# EasyEDA Pro project ProPrj_pbsy3.0_2025-02-05.epro

# Schematic Schematic1
Board Name: Board1; Create Date: 2025-01-28; Page Name: P1; Project Name: pbsy3.0; Schematic Name: Schematic1; Update Date: 2025-02-05; Company: King; Page Size: A4; Version: V1.0
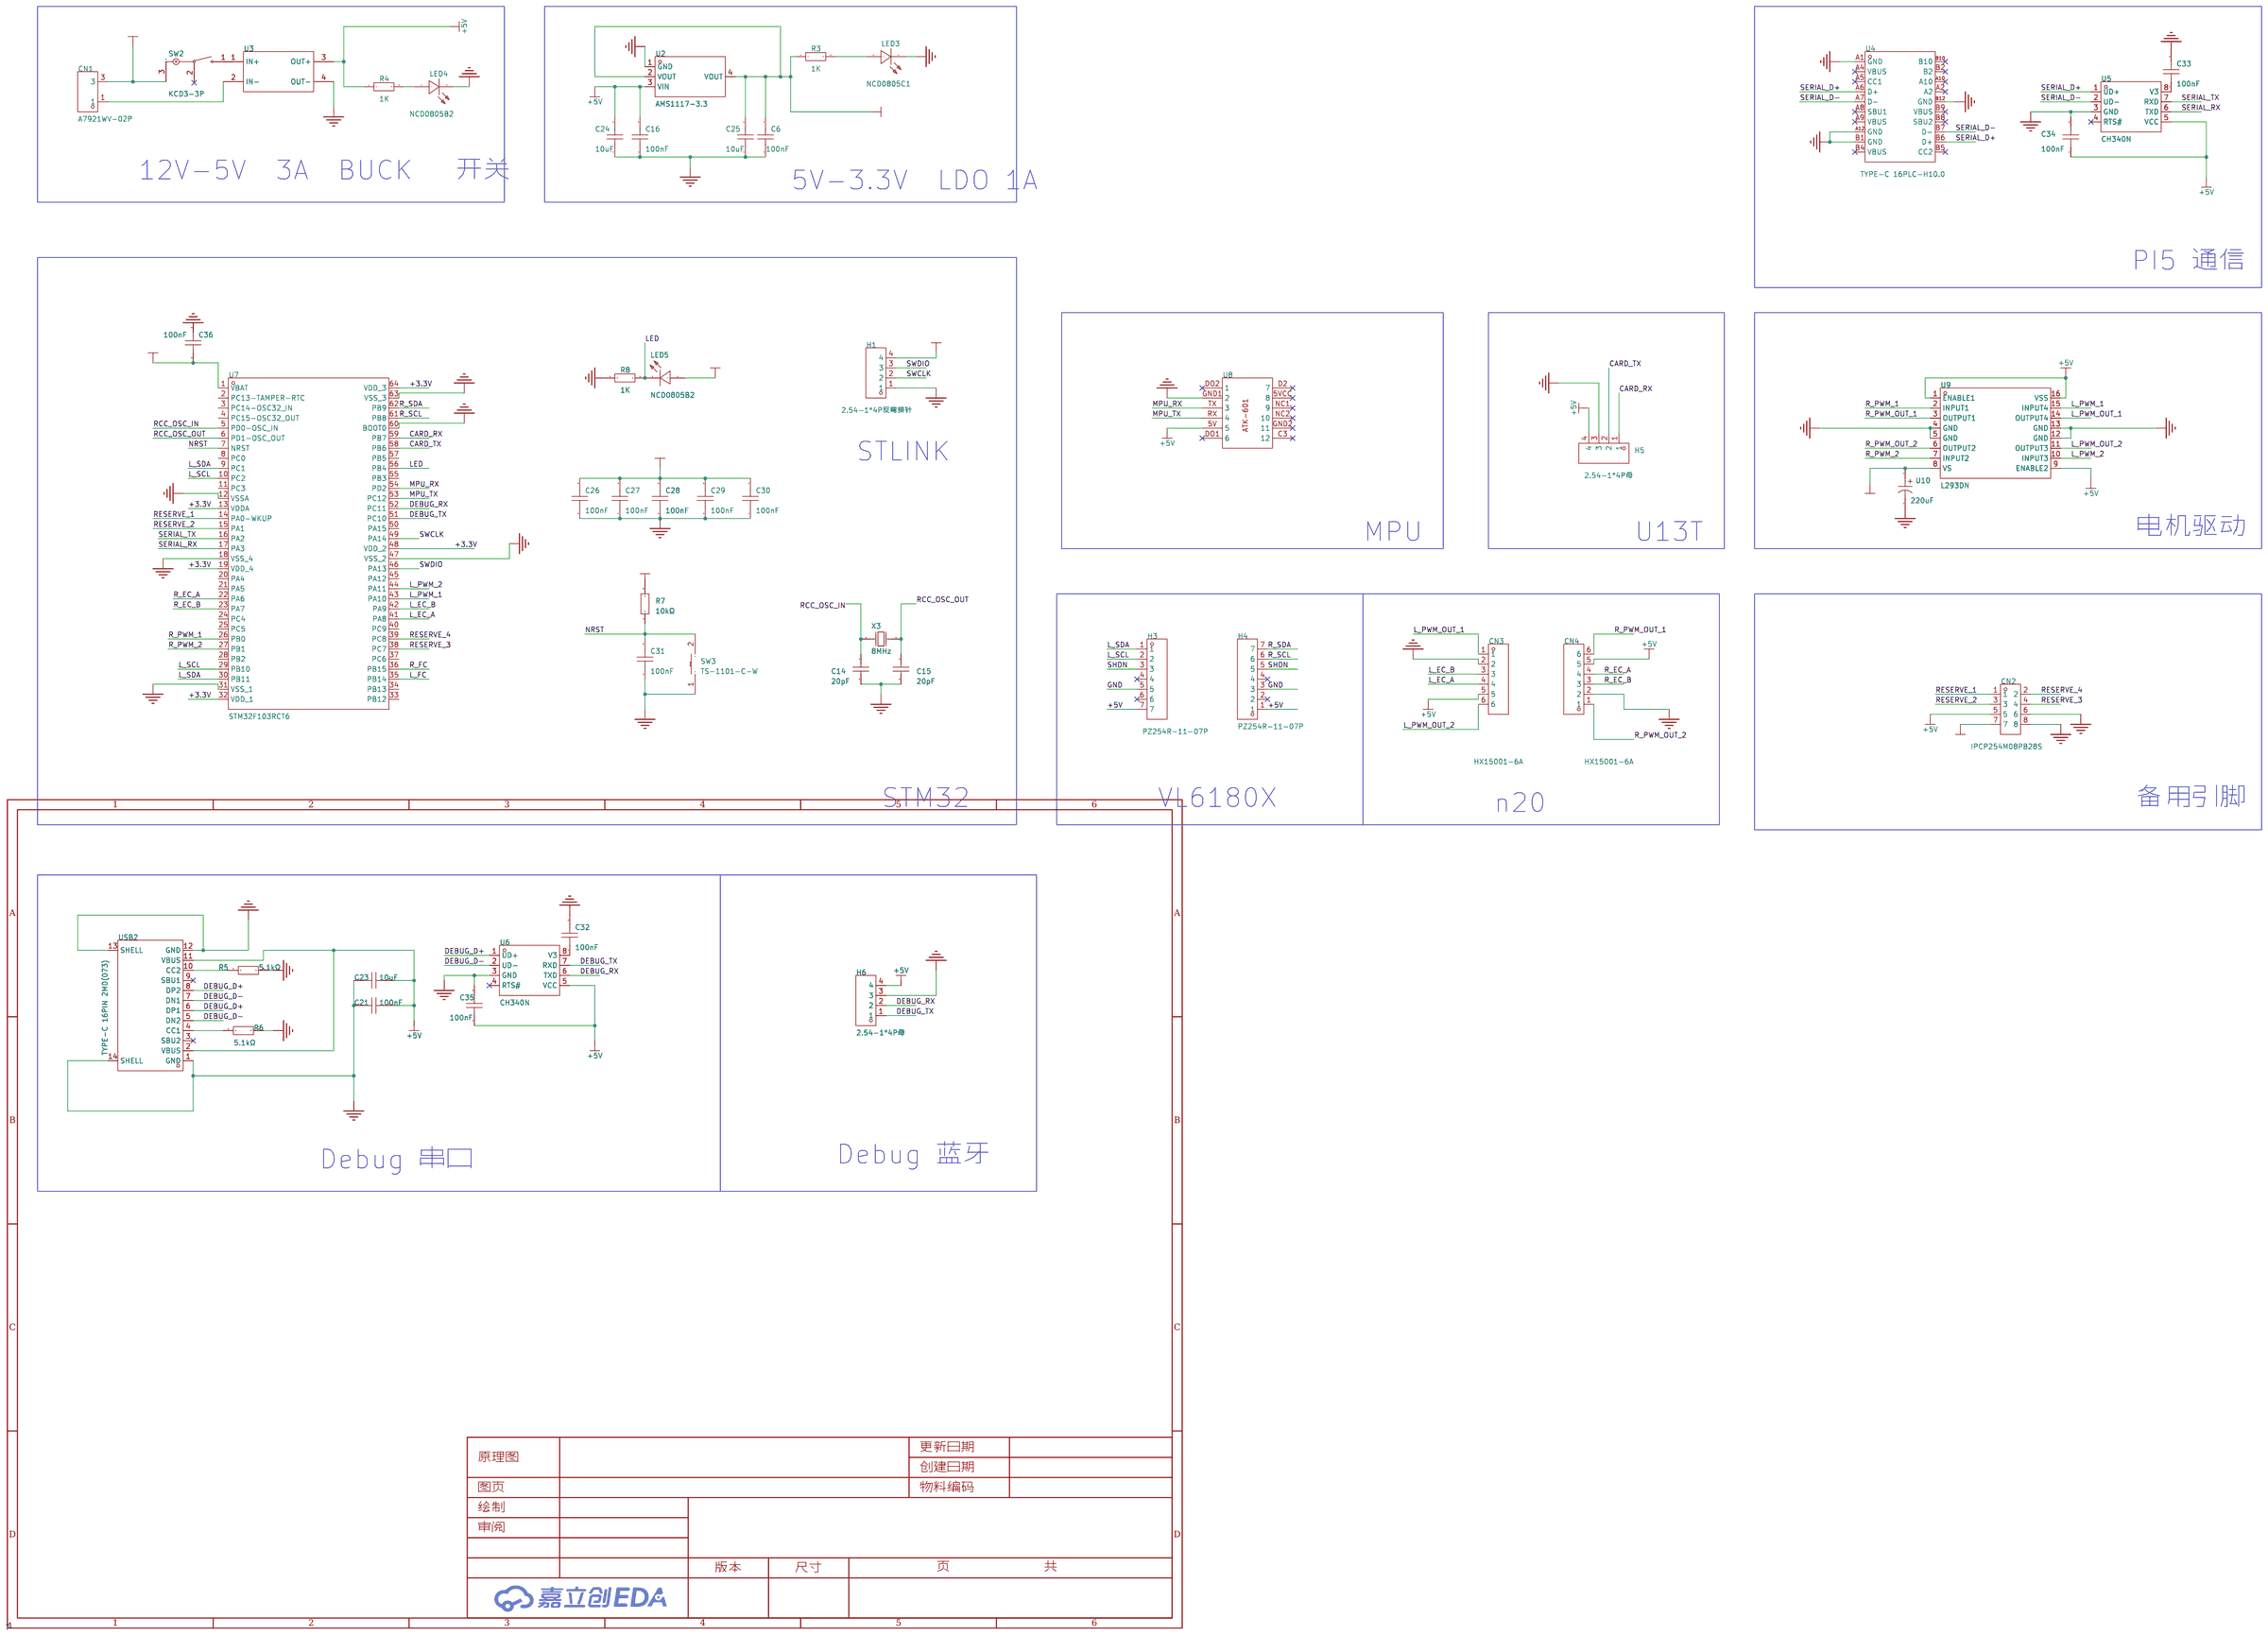
[diagram p0: schematic sheet]

## Parts
C6  100nF  [C0603]
C14  20pF  [C0805]
C15  20pF  [C0805]
C16  100nF  [C0603]
C21  100nF  [C0603]
C23  10uF  [C0805]
C24  10uF  [C0805]
C25  10uF  [C0805]
C26  100nF  [C0603]
C27  100nF  [C0603]
C28  100nF  [C0603]
C29  100nF  [C0603]
C30  100nF  [C0603]
C31  100nF  [C0603]
C32  100nF  [C0603]
C33  100nF  [C0603]
C34  100nF  [C0603]
C35  100nF  [C0603]
C36  100nF  [C0603]
CN1  A7921WV-02P  [CONN-TH_A7921WR-02P]
CN2  IPCP254M08PB28S  [HDR-SMD_8P-P2.54-V-M-R2-C4-S2.54-LS7.4]
CN3  HX15001-6A  [CONN-TH_HX15001-6A]
CN4  HX15001-6A  [CONN-TH_HX15001-6A]
H1  2.54-1*4P反弯排针  [HDR-TH_4P-P2.54-H-M-W10.4]
H3  PZ254R-11-07P  [HDR-TH_7P-P2.54-H-M-W10.4]
H4  PZ254R-11-07P  [HDR-TH_7P-P2.54-H-M-W10.4]
H5  2.54-1*4P母  [HDR-TH_4P-P2.54-V-F]
H6  2.54-1*4P母  [HDR-TH_4P-P2.54-V-F]
LED3  NCD0805C1  [LED0805-RD]
LED4  NCD0805B2  [LED0805-R-RD]
LED5  NCD0805B2  [LED0805-R-RD]
R3  1K  [R0603]
R4  1K  [R0603]
R5  5.1kΩ  [R0603]
R6  5.1kΩ  [R0603]
R7  10kΩ  [R0603]
R8  1K  [R0603]
SW2  KCD3-3P  [SW-TH_KCD3-3P]
SW3  TS-1101-C-W  [SW-SMD_L6.0-W3.3-LS8.0]
U2  AMS1117-3.3  [SOT-223-3_L6.5-W3.4-P2.30-LS7.0-BR]
U3  -  [12v-5v]
U4  TYPE-C 16PLC-H10.0  [TYPE-C-TH_16PLC-H10.0]
U5  CH340N  [SOP-8_L4.9-W3.9-P1.27-LS6.0-BL]
U6  CH340N  [SOP-8_L4.9-W3.9-P1.27-LS6.0-BL]
U7  STM32F103RCT6  [LQFP-64_L10.0-W10.0-P0.50-LS12.0-BL]
U8  -  [ATK-601]
U9  L293DN  [DIP-16_L19.2-W6.6-P2.54-LS7.6-BL]
U10  220uF  [CAP-SMD_BD10.0-L10.3-W10.3-LS11.3-FD]
USB2  TYPE-C 16PIN 2MD(073)  [USB-C-SMD_TYPE-C-6PIN-2MD-073]
X3  8MHz  [CRYSTAL-SMD_L5.0-W3.2]

## Library data of the parts
C6 C16 C21 C26-C36 = CC0603KRX7R9BB104: 容值:100nF;精度:±10%;额定电压:50V;材质(温度系数):X7R;; LCSC Part Name: 100nF ±10% 50V; Supplier Part: C14663; Manufacturer: YAGEO(国巨); Supplier Footprint: 0603; JLCPCB Part Class: 基础库; Datasheet: https://atta.szlcsc.com/upload/public/pdf/source/20180910/C282072_33301C7F631E79921B82A8DAC6BCC5B3.pdf; Supplier: LCSC; Tolerance: ±10%; Voltage Rated: 50V; Temperature Coefficient: X7R
C14 C15 = CL21C200JBANNNC: 容值:20pF;精度:±5%;额定电压:50V;材质(温度系数):C0G;; LCSC Part Name: 20pF ±5% 50V; Supplier Part: C1798; Manufacturer: SAMSUNG(三星); Supplier Footprint: 0805; JLCPCB Part Class: 基础库; Datasheet: https://atta.szlcsc.com/upload/public/pdf/source/20160218/1457707763339.pdf; Supplier: LCSC; Tolerance: ±5%; Voltage Rated: 50V; Temperature Coefficient: C0G
C23-C25 = CL21A106KAYNNNE_C15850: 容值:10uF;精度:±10%;额定电压:25V;材质(温度系数):X5R;; LCSC Part Name: 10uF ±10% 25V; Supplier Part: C15850; Manufacturer: SAMSUNG(三星); Manufacturer Part: CL21A106KAYNNNE; Supplier Footprint: 0805; JLCPCB Part Class: 基础库; Datasheet: https://atta.szlcsc.com/upload/public/pdf/source/20160218/1457707763339.pdf; Supplier: LCSC; Tolerance: ±10%; Voltage Rated: 25V; Temperature Coefficient: X5R
CN1 = A7921WV-02P: 插针结构:1x2P;间距:7.92mm;安装方式:直插;参考系列:-;总PIN数:2P;排数:1;每排PIN数:2;行距:-;额定电流:7A;工作温度范围:-25℃~+85℃;; LCSC Part Name: 1x2P 间距:7.92mm 直插 白色; Supplier Part: C476951; Manufacturer: HR(灿达); Supplier Footprint: 插件,P=7.92mm; JLCPCB Part Class: 扩展库; Datasheet: https://atta.szlcsc.com/upload/public/pdf/source/20191226/C476955_2C3804F24164FF17738B2D3E59120688.pdf; Supplier: LCSC; Pins Structure: 1x2P; Pitch: 7.92mm; Mounting Style: 直插; Number of Pins: 2P; Number of Rows: 1; Number of PINs Per Row: 2; Current Rating (Max): 7A; Operating Temperature Range: -25℃~+85℃
CN2 = IPCP254M08PB28S: 插针结构:2x4P;间距:2.54mm;行距:2.54mm;圆针/方针:方针;安装类型:立贴;排数:双排;总PIN位数:8P;额定电流:3A;额定电压:-;塑高:2.5mm;触头材质:黄铜;触头镀层:金;工作温度范围:-40℃~+105℃;颜色:黑色;; LCSC Part Name: 2x4P 间距:2.54mm 方针 立贴; Supplier Part: C22438448; Manufacturer: INCP; Supplier Footprint: SMD,P=2.54mm; JLCPCB Part Class: 扩展库; Datasheet: https://atta.szlcsc.com/upload/public/pdf/source/20240509/094DB0710888307F3FE8E0964C322F79.pdf; Supplier: LCSC; Pin Structure: 2x4P; Pitch: 2.54mm; Row Spacing: 2.54mm; Circluar Pins/Square Pins: 方针; Mounting Type: 立贴; Number of Rows: 双排; Number of Pins: 8P; Current Rating (Max): 3A; Insulation Height: 2.5mm; Contact Material: 黄铜; Contact Plating: 金; Operating Temperature Range: -40℃~+105℃; Color: 黑色
CN3 CN4 = HX15001-6A: 插针结构:1x6P;间距:1.5mm;安装方式:直插;参考系列:-;总PIN数:6P;排数:1;每排PIN数:6;行距:-;额定电流:1A;工作温度范围:-25℃~+85℃;; LCSC Part Name: 1x6P 间距:1.5mm 直插; Supplier Part: C442120; Manufacturer: HX(红星); Supplier Footprint: 插件,P=1.5mm; JLCPCB Part Class: 扩展库; Datasheet: https://atta.szlcsc.com/upload/public/pdf/source/20200415/C442122_6099D15A4C447C911EDDF6034E95C63F.pdf; Supplier: LCSC; Pins Structure: 1x6P; Pitch: 1.5mm; Mounting Style: 直插; Number of Pins: 6P; Number of Rows: 1; Number of PINs Per Row: 6; Current Rating (Max): 1A; Operating Temperature Range: -25℃~+85℃
H1 = 2.54-1*4P反弯排针: 插针结构:1x4P;间距:2.54mm;行距:-;圆针/方针:方针;安装类型:弯插;排数:单排;总PIN位数:4P;额定电流:3A;额定电压:-;配合针长度:6mm;塑高:-;端接针长度:-;触头材质:-;触头镀层:-;工作温度范围:-55℃~+105℃;颜色:黑色;; LCSC Part Name: 间距:2.54mm 1x4P 弯插 方针; Supplier Part: C91552; Manufacturer: BOOMELE(博穆精密); Supplier Footprint: 弯插,P=2.54mm; JLCPCB Part Class: 扩展库; Datasheet: https://atta.szlcsc.com/upload/public/pdf/source/20190508/C74252_03DDEC4696EE17172E44B96636392962.pdf; Supplier: LCSC; Pin Structure: 1x4P; Pitch: 2.54mm; Circluar Pins/Square Pins: 方针; Mounting Type: 弯插; Number of Rows: 单排; Number of Pins: 4P; Current Rating (Max): 3A; Length of Mating Pin: 6mm; Operating Temperature Range: -55℃~+105℃; Color: 黑色
H3 H4 = PZ254R-11-07P: 插针结构:1x7P;间距:2.54mm;行距:-;圆针/方针:方针;安装类型:弯插;排数:单排;总PIN位数:7P;额定电流:-;额定电压:-;配合针长度:6mm;塑高:2.5mm;触头材质:黄铜;触头镀层:-;工作温度范围:-40℃~+105℃;颜色:黑色;; LCSC Part Name: 间距:2.54mm 1x7P 弯插 方针; Supplier Part: C492415; Manufacturer: XFCN(兴飞); Supplier Footprint: 弯插,P=2.54mm; JLCPCB Part Class: 扩展库; Datasheet: https://atta.szlcsc.com/upload/public/pdf/source/20200309/C492415_DA188E9910EB3F381D5A5032EE25D5A2.pdf; Supplier: LCSC; Pin Structure: 1x7P; Pitch: 2.54mm; Circluar Pins/Square Pins: 方针; Mounting Type: 弯插; Number of Rows: 单排; Number of Pins: 7P; Length of Mating Pin: 6mm; Insulation Height: 2.5mm; Contact Material: 黄铜; Operating Temperature Range: -40℃~+105℃; Color: 黑色
H5 H6 = 2.54-1*4P母: 插孔结构:1x4P;间距:2.54mm;行距:-;圆孔/方孔:方孔;安装类型:直插;排数:单排;总孔位数:4P;额定电流:3A;额定电压:-;插孔方向:顶部;塑高:-;触头材质:青铜;触头镀层:-;工作温度范围:-40℃~+105℃;焊接温度(最大值):-;; LCSC Part Name: 间距:2.54mm 1x4P 直插; Supplier Part: C2718488; Manufacturer: BOOMELE(博穆精密); Supplier Footprint: 插件,P=2.54mm; JLCPCB Part Class: 扩展库; Datasheet: https://atta.szlcsc.com/upload/public/pdf/source/20210301/C2718488_F4427B881E42CAA8DDB0B1C12B3A522C.pdf; Supplier: LCSC; Holes Structure: 1x4P; Pitch: 2.54mm; Circular Hole / Square Hole: 方孔; Mounting Type: 直插; Number of Rows: 单排; Number of Holes: 4P; Current Rating (Max): 3A; Holes Direction: 顶部; Contact Material: 青铜; Operating Temperature Range: -40℃~+105℃
LED3 = NCD0805C1: 发光颜色:黄绿色;正向电压(VF):1.6V~2.6V;功率:65mW;正向电流:20mA;主波长:565nm~578nm;透镜颜色:无色透明透镜;发光强度:20mcd~55mcd;发光角度:130°;工作温度:-30℃~+85℃;; Supplier Part: C84257; Manufacturer: 国星光电; Supplier Footprint: 0805; JLCPCB Part Class: 扩展库; Datasheet: https://atta.szlcsc.com/upload/public/pdf/source/20200820/C84257_8E1200BAE92C082055D96FC4159EE35B.pdf; Supplier: LCSC; Emitted Color: 黄绿色; Forward Voltage (VF): 1.6V~2.6V; Power Dissipation: 65mW; Forward Current: 20mA; Dominant Wavelength: 565nm~578nm; Lens Color: 无色透明透镜; Luminous Intensity: 20mcd~55mcd; Viewing Angle: 130°; Operating Temperature: -30℃~+85℃
LED4 LED5 = NCD0805B2: 发光颜色:蓝色;正向电压(VF):2.5V~3.6V;功率:72mW;正向电流:2mA;主波长:468nm~478nm;透镜颜色:无色透明透镜;发光强度:20mcd~55mcd;发光角度:130°;工作温度:-30℃~+85℃;; Supplier Part: C84259; Manufacturer: 国星光电; Supplier Footprint: 0805; JLCPCB Part Class: 扩展库; Datasheet: https://atta.szlcsc.com/upload/public/pdf/source/20200820/C84259_E5AC6865415989C4C2C2831134BA3A23.pdf; Supplier: LCSC; Emitted Color: 蓝色; Forward Voltage (VF): 2.5V~3.6V; Power Dissipation: 72mW; Forward Current: 2mA; Dominant Wavelength: 468nm~478nm; Lens Color: 无色透明透镜; Luminous Intensity: 20mcd~55mcd; Viewing Angle: 130°; Operating Temperature: -30℃~+85℃
R3 R4 R8 = Res_0603: Supplier Footprint: 0603
R5 R6 = 0603WAF5101T5E: 电阻类型:厚膜电阻;阻值:5.1kΩ;精度:±1%;功率:100mW;最大工作电压:75V;温度系数:±100ppm/℃;; LCSC Part Name: 5.1kΩ ±1% 100mW 厚膜电阻; Supplier Part: C23186; Manufacturer: UNI-ROYAL(厚声); Supplier Footprint: 0603; JLCPCB Part Class: 基础库; Datasheet: https://atta.szlcsc.com/upload/public/pdf/source/20200306/C422600_1E6D84923E4A46A82E41ADD87F860B5C.pdf; Supplier: LCSC; Type: 厚膜电阻; Tolerance: ±1%; Power(Watts): 100mW; Overload Voltage (Max): 75V; Temperature Coefficient: ±100ppm/℃; Operating Temperature Range: -55℃~+155℃
R7 = 0603WAF1002T5E: 电阻类型:厚膜电阻;阻值:10kΩ;精度:±1%;功率:100mW;最大工作电压:75V;温度系数:±100ppm/℃;; LCSC Part Name: 厚膜电阻 10kΩ ±1% 100mW; Supplier Part: C25804; Manufacturer: UNI-ROYAL(厚声); Supplier Footprint: 0603; JLCPCB Part Class: 基础库; Datasheet: https://atta.szlcsc.com/upload/public/pdf/source/20200306/C422600_1E6D84923E4A46A82E41ADD87F860B5C.pdf; Supplier: LCSC; Type: 厚膜电阻; Tolerance: ±1%; Power(Watts): 100mW; Overload Voltage (Max): 75V; Temperature Coefficient: ±100ppm/℃; Operating Temperature Range: -55℃~+155℃
SW2 = KCD3-3P: 带灯:红灯;引脚样式:焊片;额定电流:15A;额定电压(AC):250V;额定电压(DC):-;电路结构:单刀单掷;机械寿命:1万次;; LCSC Part Name: 30.5*13.5mm 三脚两档跷板开关 红灯; Supplier Part: C5884419; Manufacturer: SHOU HAN(首韩); Supplier Footprint: 插件; JLCPCB Part Class: 扩展库; Datasheet: https://atta.szlcsc.com/upload/public/pdf/source/20230506/260FA8BC2C2484DDF279CBEA347AD873.pdf; Supplier: LCSC; Switch Length: 30.5mm; Switch Width: 13.5mm; Switch Height: 30mm; Actuator Type: 凹面弯曲; With Lamp: 红灯; Pin Style: 焊片; Actuator Color: 红色; Contact Current: 15A; Voltage Rating (AC): 250V; Circuit: 单刀单掷; Mechanical Life: 1万次; Operating Temperature: 0℃~+125℃; Actuator Identifier: - O
SW3 = TS-1101-C-W: 电路结构:单刀单掷;按钮形状:矩形按钮;作用力:260gf;安装方式:立贴;开关长度:6mm;开关宽度:3.6mm;开关高度:2.5mm;带支架:不带;触点电流:50mA;额定电压(AC):-;额定电压(DC):12V;额定功率:-;绝缘电阻:-;带灯:无;机械寿命:5万次;; LCSC Part Name: 6*3.6*2.5mm 立贴 轻触开关; Supplier Part: C318938; Manufacturer: XKB Connectivity(中国星坤); Supplier Footprint: SMD; JLCPCB Part Class: 扩展库; Datasheet: https://atta.szlcsc.com/upload/public/pdf/source/20200227/C318938_C2E53B1EEDE37D980A33616AC086DE53.pdf; Supplier: LCSC; Circuit: 单刀单掷; Actuator Style: 矩形按钮; Operating Force: 260gf; Mounting Style: 立贴; Switch Length: 6mm; Switch Width: 3.6mm; Switch Height: 2.5mm; Strike Gundam: 不带; Contact Current: 50mA; Voltage Rating (DC): 12V; Actuator/Cap Color: 白色带淡绿; With Lamp: 无; Mechanical Life: 5万次; Operating Temperature: -30℃~+85℃
U2 = AMS1117-3.3_C6186: 输出类型:固定;最大输入电压:-;输出电压:3.3V;最大输出电流:1A;电源纹波抑制比(PSRR):72dB@(120Hz);输出极性:正极;; LCSC Part Name: 输出3.3V 1A; Supplier Part: C6186; Manufacturer: AMS; Supplier Footprint: SOT-223; JLCPCB Part Class: 基础库; Datasheet: https://atta.szlcsc.com/upload/public/pdf/source/20180727/C6186_7A095716F0823C02F1997A905E26C086.pdf; Supplier: LCSC; Output Type: 固定; Output Voltage: 3.3V; MAX Output Current: 1A; Power Supply Rejection Ratio (PSRR): 72dB@(120Hz); Dropout Voltage: 1.3V@(800mA); Output Polarity: 正极; Number of Outputs: 1
U3 = 12v-5v
U4 = TYPE-C 16PLC-H10.0: 连接器类型:Type-C;标准:USB 3.1;公母:母;安装方式:直插;触点数量:16P;端口数量:1;额定电流 - 电源:5A;触头材质:-;触头镀层:-;工作温度范围:-40℃~+85℃;; LCSC Part Name: Type-C 母 直插; Supplier Part: C3151747; Manufacturer: SHOU HAN(首韩); Supplier Footprint: 插件; JLCPCB Part Class: 扩展库; Datasheet: https://atta.szlcsc.com/upload/public/pdf/source/20240529/CC9428849977884A813B584EA396EFE9.pdf; Supplier: LCSC; Connector Type: Type-C; Standard: USB 3.1; Gender: 母; Mounting Style: 直插; Number of Contacts: 16P; Number of Ports: 1; Current Rating - Power (Max): 5A; Operating Temperature Range: -40℃~+85℃; Rated Voltage (Max): 20V; Connect-Disconnect Life: 1万次; Core Colour: 黑色
U5 U6 = CH340N: 应用功能:USB转串口;接口协议:USB 2.0;通道数:1;数据速率:2Mbps;; LCSC Part Name: USB转串口芯片CH340; Supplier Part: C2977777; Manufacturer: WCH(南京沁恒); Supplier Footprint: SOP-8; JLCPCB Part Class: 扩展库; Datasheet: https://atta.szlcsc.com/upload/public/pdf/source/20240313/115CDE92081B1D6CB446704AD5D0F5F2.pdf; Supplier: LCSC; Applications Function: USB转串口; Protocol: USB 2.0; Number of Channels: 1; Supply Voltage: 3.3V；5V; Data Rate: 2Mbps; Operating Temperature: -20℃~+70℃
U7 = STM32F103RCT6: CPU内核:ARM-M3;CPU最大主频:72MHz;应用领域:-;; LCSC Part Name: 主流增强型ARM Cortex-M3 MCU，具有256 KB Flash、72 MHz CPU、电机控制、USB和CAN; Supplier Part: C8323; Manufacturer: ST(意法半导体); Supplier Footprint: LQFP-64(10x10); JLCPCB Part Class: 扩展库; Datasheet: https://atta.szlcsc.com/upload/public/pdf/source/20180207/C88442_15179953708671359491.pdf; Supplier: LCSC; CPU Core: ARM-M3; CPU Maximum Speed: 72MHz; Program Storage Size: 256KB; Program Memory Type: FLASH; Number of I/O: 51; ADC (Bit): 12bit; DAC (Bit): 12bit; Low Voltage Detection Threshold: 2V~3.6V
U8 = ATK-601
U9 = L293DN: Supplier Part: C434590; Manufacturer: HGSEMI(华冠); Supplier Footprint: DIP-16; JLCPCB Part Class: 扩展库; Datasheet: https://atta.szlcsc.com/upload/public/pdf/source/20191028/C434590_76739AA00613B9BA5F2B9A4CE0855B32.pdf; Supplier: LCSC
U10 = RVT1H221M1010 220UF 50V: 容值:220uF;精度:±20%;额定电压:50V;纹波电流:230mA@120Hz;等效串联电阻:-;; LCSC Part Name: 220uF ±20% 50V; Supplier Part: C970698; Manufacturer: DMBJ(振宝佳); Supplier Footprint: SMD,D10xL10.2mm; JLCPCB Part Class: 扩展库; Datasheet: https://atta.szlcsc.com/upload/public/pdf/source/20201217/C970594_282EC4D70669AEE33806F6C24A5FAA0B.pdf; Supplier: LCSC; Tolerance: ±20%; Rated Voltage: 50V; Ripple Current: 230mA@120Hz; φD: 10mm; L: 10.2mm; Lifetime @ Temp: 2800hrs@105℃; Operating Temperature: -55℃~+105℃
USB2 = TYPE-C 16PIN 2MD(073): 连接器类型:Type-C;标准:USB 3.1;公母:母;安装方式:卧贴;触点数量:16P;端口数量:1;额定电流 - 电源:5A;工作温度范围:-25℃~+85℃;; LCSC Part Name: Type-C 母 卧贴; Supplier Part: C2765186; Manufacturer: SHOU HAN(首韩); Supplier Footprint: SMD; JLCPCB Part Class: 扩展库; Datasheet: https://atta.szlcsc.com/upload/public/pdf/source/20211123/39B17C16241EAC15C5E277BDA434118E.pdf; Supplier: LCSC; Connector Type: Type-C; Standard: USB 3.1; Gender: 母; Mounting Style: 卧贴; Number of Contacts: 16P; Number of Ports: 1; Current Rating - Power (Max): 5A; Operating Temperature Range: -25℃~+85℃; Rated Voltage (Max): 5V; Connect-Disconnect Life: 5千次; Core Colour: 黑色
X3 = X50328MSB2GI: 晶振类型:贴片晶振;频率:8MHz;常温频差:±10ppm;外接负载电容:20pF;频率稳定度(全温):±20ppm;; LCSC Part Name: 8MHz ±10ppm 20pF YSX530GA; Supplier Part: C115962; Manufacturer: YXC(扬兴晶振); Supplier Footprint: SMD5032; JLCPCB Part Class: 基础库; Datasheet: https://atta.szlcsc.com/upload/public/pdf/source/20240329/44922B0AF7B60E58E9B66993B6077277.pdf; Supplier: LCSC; Crystal Type: 贴片晶振; Normal temperature Frequency Tolerance: ±10ppm; External load capacitor: 20pF; Frequency Stability(Full temperature range): ±20ppm; Operating Temperature: -40℃~+85℃

## Nets
+3.3V: C6.2 C25.2 C26.2 C27.2 C28.2 C29.2 C30.2 C36.1 CN2.7 H1.4 LED5.1(+) R3.1 R7.2 U2.2(VOUT) U2.4(VOUT) U7.1(VBAT) U7.13(VDDA) U7.19(VDD_4) U7.32(VDD_1) U7.48(VDD_2) U7.64(VDD_3)
+5V: C16.2 C21.2 C23.2 C24.2 C34.1 C35.1 CN2.5 CN3.5 CN4.5 H3.7 H4.1 H5.4 H6.4 R4.1 U2.3(VIN) U3.3(OUT+) U5.5(VCC) U6.5(VCC) U8.5V(5) U9.1(ENABLE1) U9.9(ENABLE2) U9.16(VSS) USB2.2(VBUS) USB2.11(VBUS)
+12V: CN1.3 SW2.3 U9.8(VS) U10.1
GND: C6.1 C14.1 C15.1 C16.1 C21.1 C23.1 C24.1 C25.1 C26.1 C27.1 C28.1 C29.1 C30.1 C31.1 C32.2 C33.2 C34.2 C35.2 C36.2 CN2.6 CN2.8 CN3.2 CN4.2 H1.1 H3.5 H4.3 H5.3 H6.3 LED3.1(K) LED4.2(-) R5.2 R6.2 R8.1 SW3.1 U2.1(GND) U3.4(OUT-) U4.A1(GND) U4.A12(GND) U4.B1(GND) U4.B12(GND) U5.3(GND) U6.3(GND) U7.12(VSSA) U7.18(VSS_4) U7.31(VSS_1) U7.47(VSS_2) U7.60(BOOT0) U7.63(VSS_3) U8.GND1(2) U9.4(GND) U9.5(GND) U9.12(GND) U9.13(GND) U10.2 USB2.1(GND) USB2.12(GND) USB2.13(SHELL) USB2.14(SHELL)
CARD_RX: H5.1 U7.59(PB7)
CARD_TX: H5.2 U7.58(PB6)
DEBUG_D+: U6.1(UD+) USB2.6(DP1) USB2.8(DP2)
DEBUG_D-: U6.2(UD-) USB2.5(DN2) USB2.7(DN1)
DEBUG_RX: H6.2 U6.6(TXD) U7.52(PC11)
DEBUG_TX: H6.1 U6.7(RXD) U7.51(PC10)
L_EC_A: CN3.4 U7.41(PA8)
L_EC_B: CN3.3 U7.42(PA9)
L_FC: U7.35(PB14)
L_PWM_1: U7.43(PA10) U9.15(INPUT4)
L_PWM_2: U7.44(PA11) U9.10(INPUT3)
L_PWM_OUT_1: CN3.1 U9.14(OUTPUT4)
L_PWM_OUT_2: CN3.6 U9.11(OUTPUT3)
L_SCL: H3.2 U7.10(PC2) U7.29(PB10)
L_SDA: H3.1 U7.9(PC1) U7.30(PB11)
LED: LED5.2(-) R8.2 U7.56(PB4)
MPU_RX: U7.54(PD2) U8.TX(3)
MPU_TX: U7.53(PC12) U8.RX(4)
NRST: C31.2 R7.1 SW3.2 U7.7(NRST)
R_EC_A: CN4.4 U7.22(PA6)
R_EC_B: CN4.3 U7.23(PA7)
R_FC: U7.36(PB15)
R_PWM_1: U7.26(PB0) U9.2(INPUT1)
R_PWM_2: U7.27(PB1) U9.7(INPUT2)
R_PWM_OUT_1: CN4.6 U9.3(OUTPUT1)
R_PWM_OUT_2: CN4.1 U9.6(OUTPUT2)
R_SCL: H4.6 U7.61(PB8)
R_SDA: H4.7 U7.62(PB9)
RCC_OSC_IN: C14.2 U7.5(PD0-OSC_IN) X3.1(OSC1)
RCC_OSC_OUT: C15.2 U7.6(PD1-OSC_OUT) X3.2(OSC2)
RESERVE_1: CN2.1 U7.14(PA0-WKUP)
RESERVE_2: CN2.3 U7.15(PA1)
RESERVE_3: CN2.4 U7.38(PC7)
RESERVE_4: CN2.2 U7.39(PC8)
SERIAL_D+: U4.A6(D+) U4.B6(D+) U5.1(UD+)
SERIAL_D-: U4.A7(D-) U4.B7(D-) U5.2(UD-)
SERIAL_RX: U5.6(TXD) U7.17(PA3)
SERIAL_TX: U5.7(RXD) U7.16(PA2)
SHDN: H3.3 H4.5
SWCLK: H1.2 U7.49(PA14)
SWDIO: H1.3 U7.46(PA13)
$1N7748: CN1.1 U3.2(IN-)
$1N7874: LED4.1(+) R4.2
$1N7940: SW2.1 U3.1(IN+)
$1N8288: LED3.2(A) R3.2
$1N11654: C33.1 U5.8(V3)
$1N23863: C32.1 U6.8(V3)
$1N23878: R5.1 USB2.10(CC2)
$1N23879: R6.1 USB2.4(CC1)

Not connected (* = marked no-connect by the designer): H3 4* 6*; H4 2* 4*; SW2 2*; U4 A2* A4(VBUS)* A5(CC1)* A8(SBU1)* A9(VBUS)* A10* B2* B4(VBUS)* B5(CC2)* B8(SBU2)* B9(VBUS)* B10*; U5 4(RTS#)*; U6 4(RTS#)*; U7 2(PC13-TAMPER-RTC) 3(PC14-OSC32_IN) 4(PC15-OSC32_OUT) 8(PC0) 11(PC3) 20(PA4) 21(PA5) 24(PC4) 25(PC5) 28(PB2) 33(PB12) 34(PB13) 37(PC6) 40(PC9) 45(PA12) 50(PA15) 55(PB3) 57(PB5); U8 5VCC(8)* C3(12)* D2(7)* DO1(6)* DO2(1)* GND2(11)* NC1(9)* NC2(10)*; USB2 3(SBU2)* 9(SBU1)*

## Notes on the sheet
- 12V-5V  3A  BUCK   开关
- 5V-3.3V  LDO 1A
- PI5 通信
- STLINK
- MPU
- U13T
- 电机驱动
- STM32
- VL6180X
- n20
- 备用引脚
- Debug 串口
- Debug 蓝牙

# Board PCB1
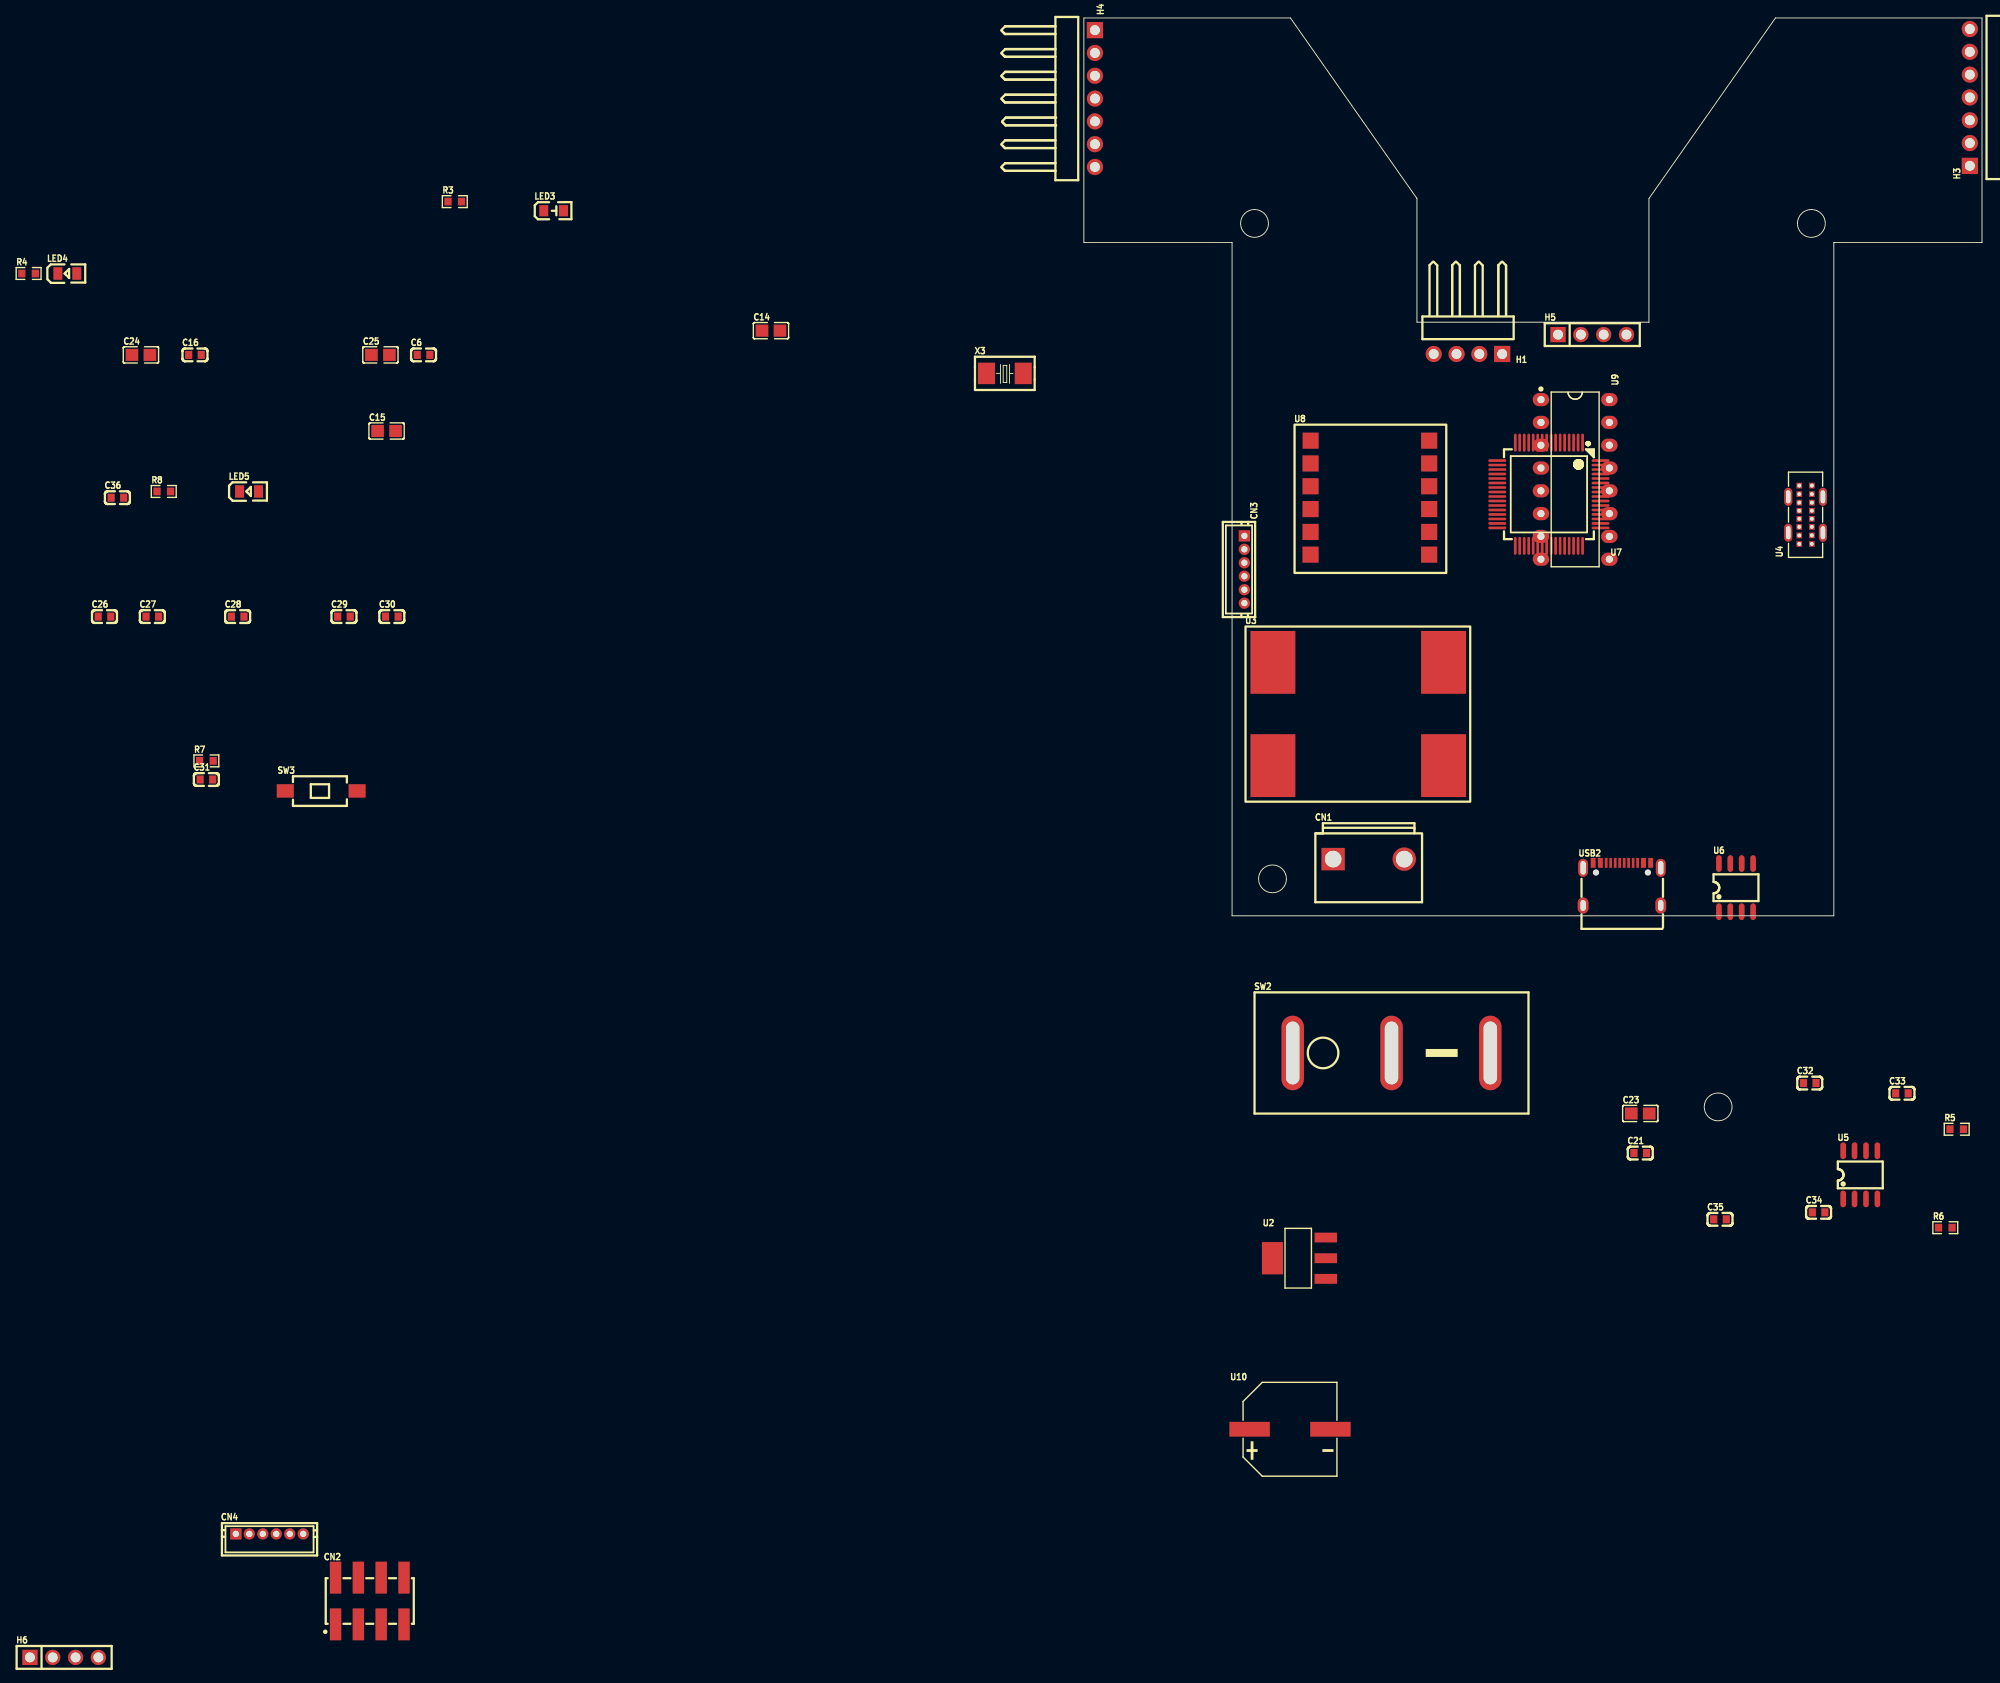
[diagram p1: board, top side]
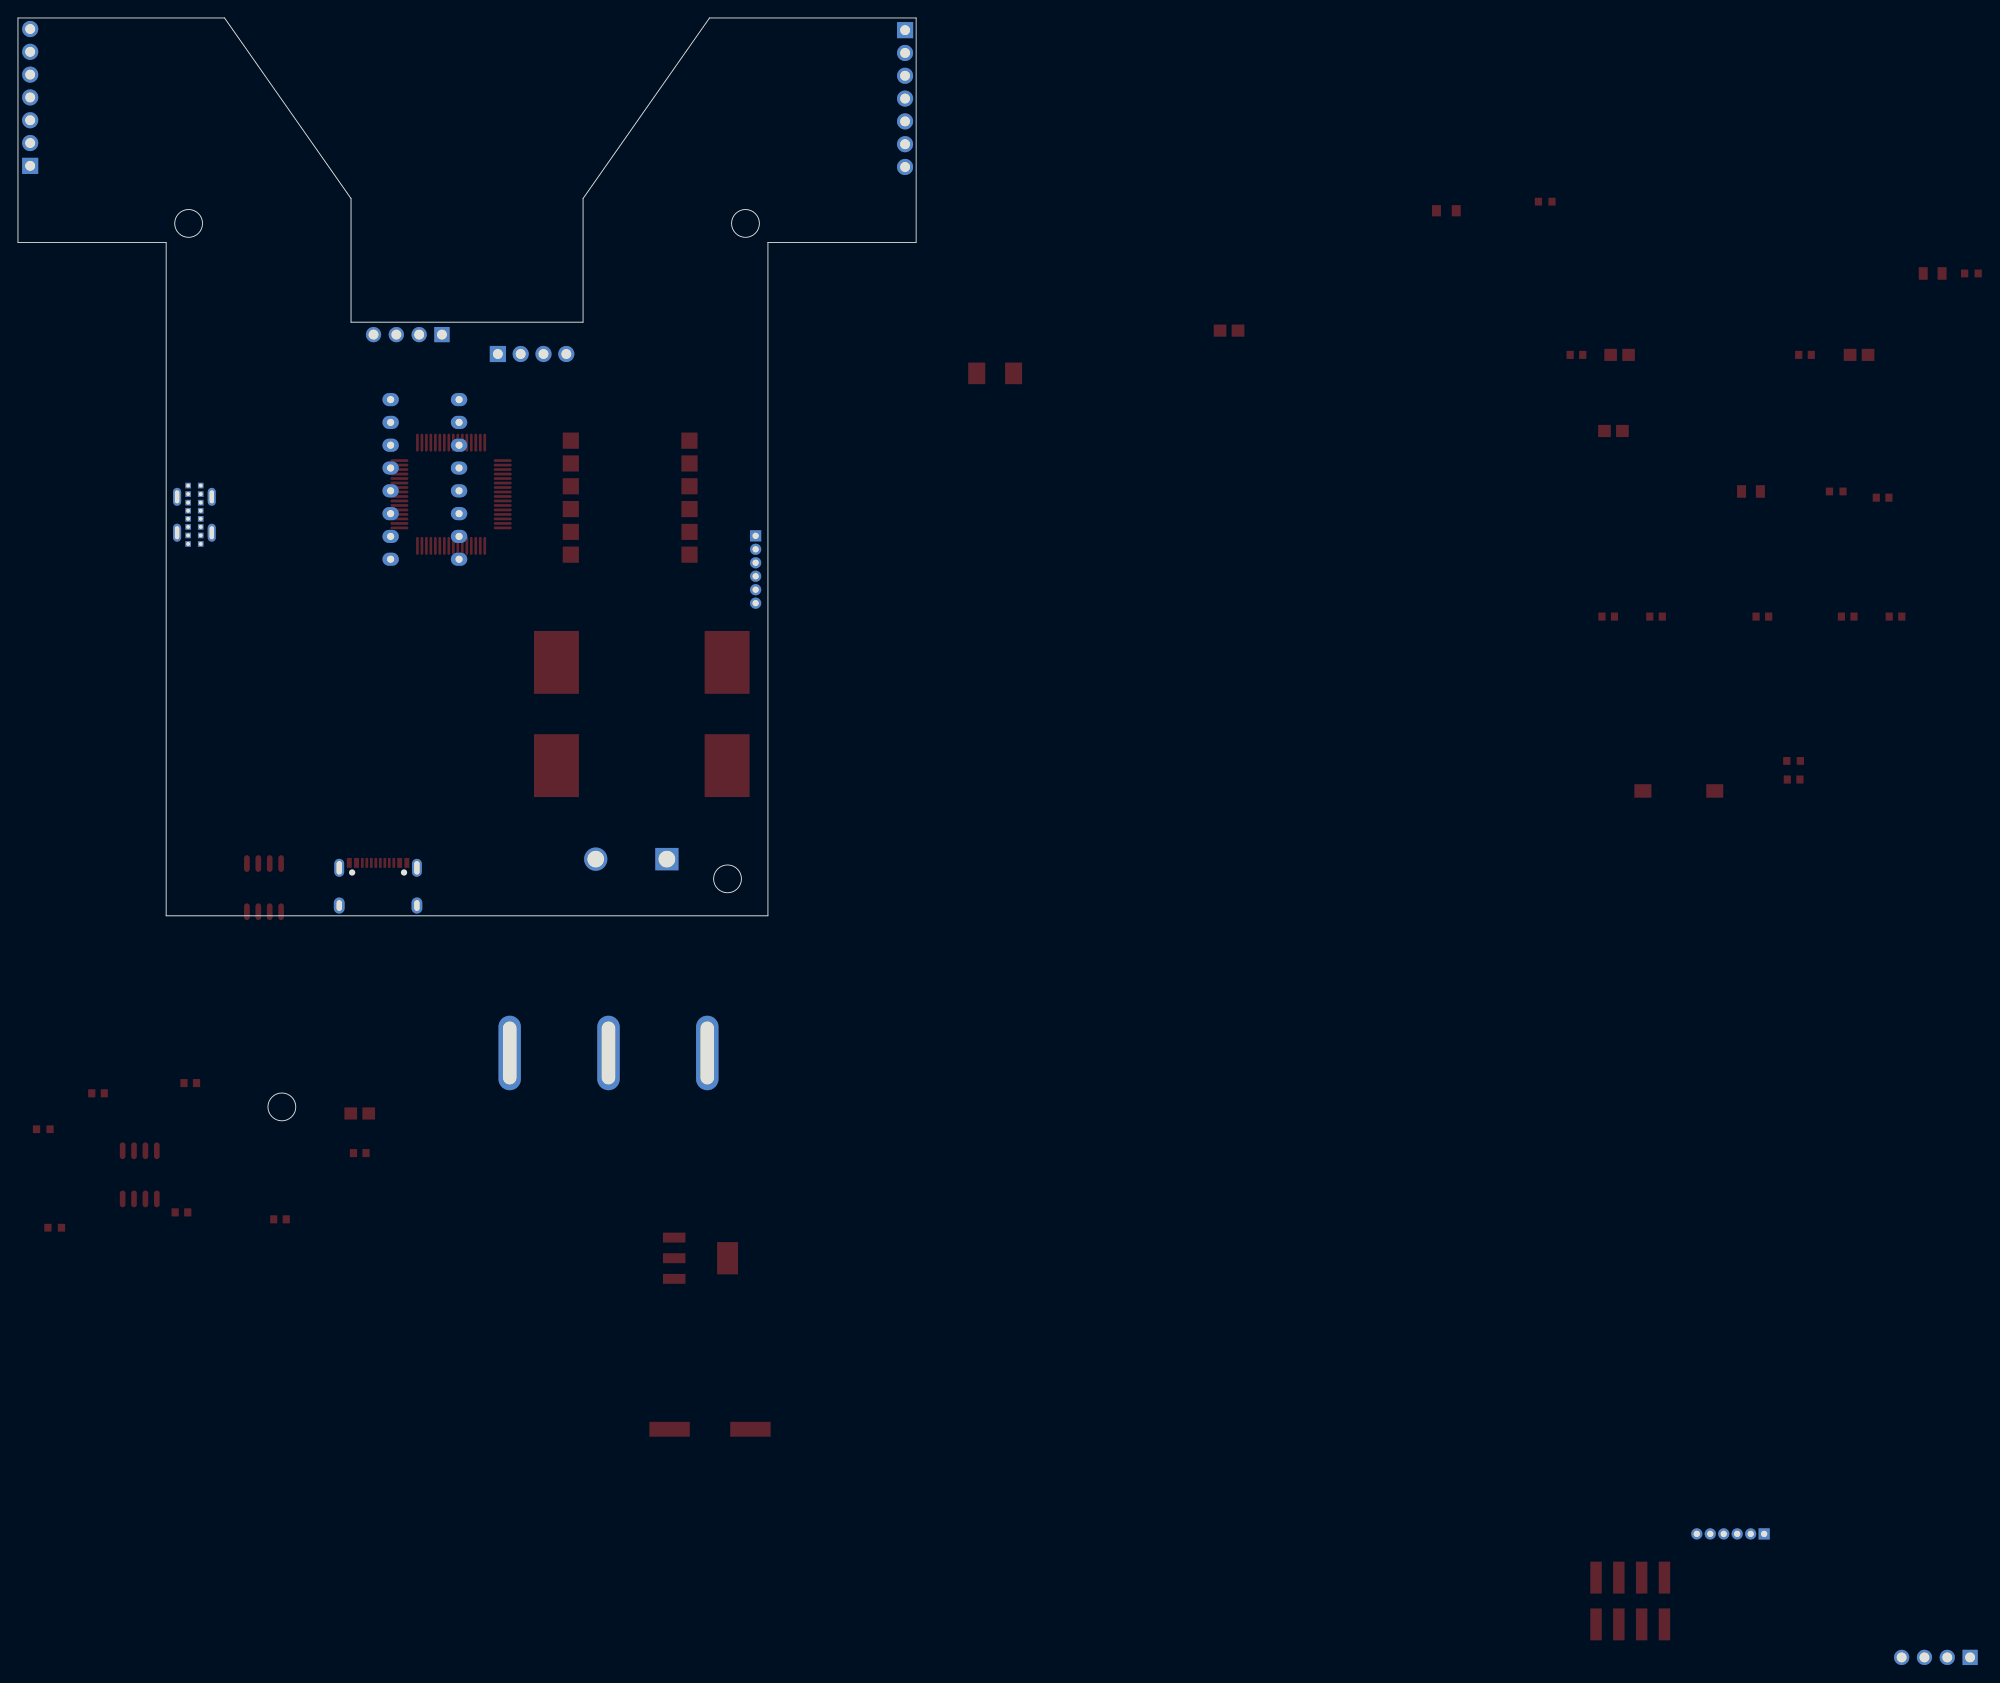
[diagram p2: board, bottom side, seen from below]

Outline 100 x 122.84 mm; copper layers: Top Layer, Bottom Layer. Coordinates in mm from the lower left corner of the outline.
Outline path: circle c19,99.95 r1.55 ; circle c21,26.95 r1.55 ; circle c70.62,1.55 r1.55 ; circle c81,99.95 r1.55 ; 0,122.84 0,97.84 16.5,97.84 16.5,22.84 83.5,22.84 83.5,97.84 100,97.84 100,122.84 77,122.84 62.92,102.72 62.92,88.95 37.08,88.95 37.08,102.72 23,122.84 0,122.84
Stack: Top Layer 0.035mm / Dielectric1 1.51mm FR4 er 4.5 / Bottom Layer 0.035mm

## Design rules (mm)
template: JLCPCB Capability(Two Layers Board)
spacing copperThickness1oz (default): track to track 0.102, other pairs 0.152 to 0.3
spacing copperThickness2oz: track to track 0.203, other pairs 0.152 to 0.3
track width copperThickness1oz (default): min 0.127, default 0.254, max 2.54
track width copperThickness2oz: min 0.203, default 0.254, max 2.54
differential pair differentialPair (default): width min 0.127, default 0.254, max 2.54; gap min 0.152, default 0.152
via viaSize (default): diameter min 0.5, default 0.61, max 10; hole min 0.3, default 0.305, max 6.3

## Placement (name value [footprint] x y rotation side)
C6  100nF  [C0603]  -73.52 85.31 0 top
C14  20pF  [C0805]  -34.84 88.01 0 top
C15  20pF  [C0805]  -77.64 76.83 0 top
C16  100nF  [C0603]  -98.97 85.31 0 top
C21  100nF  [C0603]  61.95 -3.59 0 top
C23  10uF  [C0805]  61.95 0.82 0 top
C24  10uF  [C0805]  -104.99 85.31 0 top
C25  10uF  [C0805]  -78.32 85.31 0 top
C26  100nF  [C0603]  -109.04 56.16 0 top
C27  100nF  [C0603]  -103.72 56.16 0 top
C28  100nF  [C0603]  -94.22 56.16 0 top
C29  100nF  [C0603]  -82.38 56.16 0 top
C30  100nF  [C0603]  -77.05 56.16 0 top
C31  100nF  [C0603]  -97.7 38.01 0 top
C32  100nF  [C0603]  80.82 4.21 0 top
C33  100nF  [C0603]  91.09 3.07 0 top
C34  100nF  [C0603]  81.8 -10.19 0 top
C35  100nF  [C0603]  70.83 -10.97 0 top
C36  100nF  [C0603]  -107.61 69.41 0 top
CN1  A7921WV-02P  [CONN-TH_A7921WR-02P]  31.71 29.15 0 top
CN2  IPCP254M08PB28S  [HDR-SMD_8P-P2.54-V-M-R2-C4-S2.54-LS7.4]  -79.51 -53.48 0 top
CN3  HX15001-6A  [CONN-TH_HX15001-6A]  17.87 61.41 270 top
CN4  HX15001-6A  [CONN-TH_HX15001-6A]  -90.67 -46.01 0 top
H1  2.54-1*4P反弯排针  [HDR-TH_4P-P2.54-H-M-W10.4]  42.76 85.41 180 top
H3  PZ254R-11-07P  [HDR-TH_7P-P2.54-H-M-W10.4]  98.64 113.98 90 top
H4  PZ254R-11-07P  [HDR-TH_7P-P2.54-H-M-W10.4]  1.23 113.86 270 top
H5  2.54-1*4P母  [HDR-TH_4P-P2.54-V-F]  56.6 87.57 0 top
H6  2.54-1*4P母  [HDR-TH_4P-P2.54-V-F]  -113.54 -59.76 0 top
LED3  NCD0805C1  [LED0805-RD]  -59.04 101.36 0 top
LED4  NCD0805B2  [LED0805-R-RD]  -113.18 94.38 0 top
LED5  NCD0805B2  [LED0805-R-RD]  -92.95 70.1 0 top
R3  1K  [R0603]  -70.04 102.38 0 top
R4  1K  [R0603]  -117.49 94.38 0 top
R5  5.1kΩ  [R0603]  97.18 -0.94 0 top
R6  5.1kΩ  [R0603]  95.91 -11.9 0 top
R7  10kΩ  [R0603]  -97.7 40.09 0 top
R8  1K  [R0603]  -102.45 70.1 0 top
SW2  KCD3-3P  [SW-TH_KCD3-3P]  34.25 7.56 0 top
SW3  TS-1101-C-W  [SW-SMD_L6.0-W3.3-LS8.0]  -84.92 36.74 0 top
U2  AMS1117-3.3  [SOT-223-3_L6.5-W3.4-P2.30-LS7.0-BR]  23.97 -15.3 0 top
U3  -  [12v-5v]  30.7 45.4 0 top
U4  TYPE-C 16PLC-H10.0  [TYPE-C-TH_16PLC-H10.0]  80.35 67.5 90 top
U5  CH340N  [SOP-8_L4.9-W3.9-P1.27-LS6.0-BL]  86.44 -6.02 0 top
U6  CH340N  [SOP-8_L4.9-W3.9-P1.27-LS6.0-BL]  72.61 25.97 0 top
U7  STM32F103RCT6  [LQFP-64_L10.0-W10.0-P0.50-LS12.0-BL]  51.78 69.79 180 top
U8  -  [ATK-601]  32.35 69.15 0 top
U9  L293DN  [DIP-16_L19.2-W6.6-P2.54-LS7.6-BL]  54.7 71.44 270 top
U10  220uF  [CAP-SMD_BD10.0-L10.3-W10.3-LS11.3-FD]  22.95 -34.35 0 top
USB2  TYPE-C 16PIN 2MD(073)  [USB-C-SMD_TYPE-C-6PIN-2MD-073]  59.91 26.35 0 top
X3  8MHz  [CRYSTAL-SMD_L5.0-W3.2]  -8.8 83.25 0 top

## Footprints (pads in the part's own frame, mm; a bottom-side part is the same pattern mirrored in y, then rotated)
12v-5v
  rect 5x7 smd: 1(-9.652,5.658) 2(-9.652,-5.842) 3(9.348,5.658) 4(9.348,-5.842)
ATK-601
  rect 1.8x1.8 smd: 1(-7.104,6.604) 2(-7.112,4.064) 3(-7.112,1.524) 4(-7.112,-1.016) 5(-7.112,-3.556) 6(-7.112,-6.096) 7(6.096,6.604) 8(6.096,4.064) 9(6.096,1.524) 10(6.096,-1.016) 11(6.096,-3.556) 12(6.096,-6.096)
C0603
  rect 0.8x0.9 smd: 1(-0.7,0) 2(0.7,0)
C0805
  rect 1.41x1.35 smd: 1(-1,0) 2(1,0)
CAP-SMD_BD10.0-L10.3-W10.3-LS11.3-FD
  rect 4.5x1.65 smd: 1(-4.5,0) 2(4.5,0)
CONN-TH_A7921WR-02P
  rect 2.6x2.5 hole 1.85: 1(-3.96,0)
  round 2.6 hole 1.85: 3(3.96,0)
CONN-TH_HX15001-6A
  rect 1.25x1.25 hole 0.7: 1(-3.75,0)
  round 1.25 hole 0.7: 2(-2.25,0) 3(-0.75,0) 4(0.75,0) 5(2.25,0) 6(3.75,0)
CRYSTAL-SMD_L5.0-W3.2
  rect 1.9x2.4 smd: 1(-2.05,0) 2(2.05,0)
DIP-16_L19.2-W6.6-P2.54-LS7.6-BL
  oval 1.46x1.825 hole 0.8: 1(-8.89,-3.81) 2(-6.35,-3.81) 3(-3.81,-3.81) 4(-1.27,-3.81) 5(1.27,-3.81) 6(3.81,-3.81) 7(6.35,-3.81) 8(8.89,-3.81) 9(8.89,3.81) 10(6.35,3.81) 11(3.81,3.81) 12(1.27,3.81) 13(-1.27,3.81) 14(-3.81,3.81) 15(-6.35,3.81) 16(-8.89,3.81)
HDR-SMD_8P-P2.54-V-M-R2-C4-S2.54-LS7.4
  rect 1.27x3.56 smd: 1(-3.81,-2.605) 2(-3.81,2.605) 3(-1.27,-2.605) 4(-1.27,2.605) 5(1.27,-2.605) 6(1.27,2.605) 7(3.81,-2.605) 8(3.81,2.605)
HDR-TH_4P-P2.54-H-M-W10.4
  rect 1.8x1.8 hole 1.1: 1(-3.81,0)
  round 1.8 hole 1.1: 2(-1.27,0) 3(1.27,0) 4(3.81,0)
HDR-TH_4P-P2.54-V-F
  rect 1.7x1.7 hole 1.1: 1(-3.81,0)
  round 1.7 hole 1.1: 2(-1.27,0) 3(1.27,0) 4(3.81,0)
HDR-TH_7P-P2.54-H-M-W10.4
  rect 1.8x1.8 hole 1.1: 1(-7.62,0)
  round 1.8 hole 1.1: 2(-5.08,0) 3(-2.54,0) 4(0,0) 5(2.54,0) 6(5.08,0) 7(7.62,0)
LED0805-R-RD
  rect 1x1.399 smd: 1(1.05,0) 2(-1.05,0)
LED0805-RD
  rect 1x1.25 smd: 1(-1.1,0) 2(1.1,0)
LQFP-64_L10.0-W10.0-P0.50-LS12.0-BL
  oval 0.3x2 smd: 1(-3.75,-5.75) 2(-3.25,-5.75) 3(-2.75,-5.75) 4(-2.25,-5.75) 5(-1.75,-5.75) 6(-1.25,-5.75) 7(-0.75,-5.75) 8(-0.25,-5.75) 9(0.25,-5.75) 10(0.75,-5.75) 11(1.25,-5.75) 12(1.75,-5.75) 13(2.25,-5.75) 14(2.75,-5.75) 15(3.25,-5.75) 16(3.75,-5.75) 33(3.75,5.75) 34(3.25,5.75) 35(2.75,5.75) 36(2.25,5.75) 37(1.75,5.75) 38(1.25,5.75) 39(0.75,5.75) 40(0.25,5.75) 41(-0.25,5.75) 42(-0.75,5.75) 43(-1.25,5.75) 44(-1.75,5.75) 45(-2.25,5.75) 46(-2.75,5.75) 47(-3.25,5.75) 48(-3.75,5.75)
  oval 2x0.3 smd: 17(5.75,-3.75) 18(5.75,-3.25) 19(5.75,-2.75) 20(5.75,-2.25) 21(5.75,-1.75) 22(5.75,-1.25) 23(5.75,-0.75) 24(5.75,-0.25) 25(5.75,0.25) 26(5.75,0.75) 27(5.75,1.25) 28(5.75,1.75) 29(5.75,2.25) 30(5.75,2.75) 31(5.75,3.25) 32(5.75,3.75) 49(-5.75,3.75) 50(-5.75,3.25) 51(-5.75,2.75) 52(-5.75,2.25) 53(-5.75,1.75) 54(-5.75,1.25) 55(-5.75,0.75) 56(-5.75,0.25) 57(-5.75,-0.25) 58(-5.75,-0.75) 59(-5.75,-1.25) 60(-5.75,-1.75) 61(-5.75,-2.25) 62(-5.75,-2.75) 63(-5.75,-3.25) 64(-5.75,-3.75)
R0603
  rect 0.806x0.864 smd: 1(-0.753,0) 2(0.753,0)
SOP-8_L4.9-W3.9-P1.27-LS6.0-BL
  oval 0.63x1.865 smd: 1(-1.905,-2.683) 2(-0.635,-2.683) 3(0.635,-2.683) 4(1.905,-2.683) 5(1.905,2.683) 6(0.635,2.683) 7(-0.635,2.683) 8(-1.905,2.683)
SOT-223-3_L6.5-W3.4-P2.30-LS7.0-BR
  rect 2.5x1.1 smd: 1(2.97,-2.3) 2(2.97,0) 3(2.97,2.3)
  rect 2.34x3.6 smd: 4(-2.97,0)
SW-SMD_L6.0-W3.3-LS8.0
  rect 1.9x1.5 smd: 1(-4,0) 2(4,0)
SW-TH_KCD3-3P
  oval 2.5x8.3 hole 1.5x7: 1(-11,0) 2(0,0) 3(11,0)
TYPE-C-TH_16PLC-H10.0
  rect 0.62x0.62 hole 0.42: A1(-3.25,0.7) A4(-2.3,0.7) A5(-1.351,0.7) A6(-0.45,0.7) A7(0.45,0.7) A8(1.35,0.7) A9(2.3,0.7) A12(3.25,0.7) B1(3.25,-0.7) B4(2.3,-0.7) B5(1.35,-0.7) B6(0.45,-0.7) B7(-0.45,-0.7) B8(-1.351,-0.7) B9(-2.3,-0.7) B12(-3.25,-0.7)
  oval 2x0.9 hole 1.45x0.5: A2(-2,1.93) A10(2,1.93) B2(2,-1.93) B10(-2,-1.93)
USB-C-SMD_TYPE-C-6PIN-2MD-073
  rect 0.55x1.1 smd: 1(-3.2,2.375) 2(-2.4,2.375) 11(2.4,2.375) 12(3.2,2.375)
  rect 0.3x1.1 smd: 3(-1.75,2.375) 4(-1.25,2.375) 5(-0.75,2.375) 6(-0.25,2.375) 7(0.25,2.375) 8(0.75,2.375) 9(1.25,2.375) 10(1.75,2.375)
  oval 1.1x2 hole 0.6x1.5: 13(-4.325,1.825) 14(4.325,1.825)
  oval 1.2x1.8 hole 0.6x1.2: 13(-4.325,-2.375) 14(4.325,-2.375)

## Nets
As in the schematic, except:
+5V: C16.2 C21.2 C23.2 C24.2 C34.1 C35.1 CN2.5 CN3.5 CN4.5 H3.7 H4.1 H5.4 H6.4 R4.1 U2.3 U3.3 U5.5 U6.5 U9.1 U9.9 U9.16 USB2.2 USB2.11
GND: C6.1 C14.1 C15.1 C16.1 C21.1 C23.1 C24.1 C25.1 C26.1 C27.1 C28.1 C29.1 C30.1 C31.1 C32.2 C33.2 C34.2 C35.2 C36.2 CN2.6 CN2.8 CN3.2 CN4.2 H1.1 H3.5 H4.3 H5.3 H6.3 LED3.1 LED4.2 R5.2 R6.2 R8.1 SW3.1 U2.1 U3.4 U4.A1 U4.A12 U4.B1 U4.B12 U5.3 U6.3 U7.12 U7.18 U7.31 U7.47 U7.60 U7.63 U9.4 U9.5 U9.12 U9.13 U10.2 USB2.1 USB2.12 USB2.13 USB2.14
MPU_RX: U7.54
MPU_TX: U7.53

Pads without a net: H3 4 6; H4 2 4; SW2 2; U4 A2 A4 A5 A8 A9 A10 B2 B4 B5 B8 B9 B10; U5 4; U6 4; U7 2 3 4 8 11 20 21 24 25 28 33 34 37 40 45 50 55 57; U8 1 2 3 4 5 6 7 8 9 10 11 12; USB2 3 9
